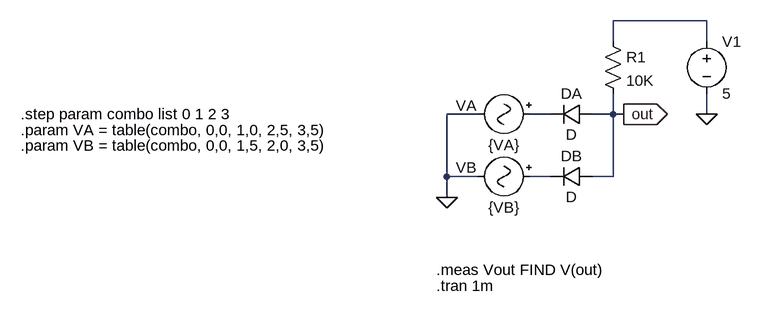
[diagram p0: schematic and_gate_diode.asc]
and_gate_diode.asc, the LTspice schematic file:
Version 4.1
SHEET 1 880 680
WIRE 304 0 160 0
WIRE 160 32 160 0
WIRE 304 32 304 0
WIRE -48 144 -96 144
WIRE 64 144 32 144
WIRE 160 144 160 112
WIRE 160 144 128 144
WIRE 176 144 160 144
WIRE 304 144 304 112
WIRE -96 240 -96 144
WIRE -48 240 -96 240
WIRE 64 240 32 240
WIRE 160 240 160 144
WIRE 160 240 128 240
WIRE -96 272 -96 240
FLAG 304 144 0
FLAG -96 272 0
FLAG 176 144 out
IOPIN 176 144 Out
SYMBOL diode 128 128 R90
WINDOW 0 0 32 VBottom 2
WINDOW 3 32 32 VTop 2
SYMATTR InstName DA
SYMBOL diode 128 224 R90
WINDOW 0 0 32 VBottom 2
WINDOW 3 32 32 VTop 2
SYMATTR InstName DB
SYMBOL res 144 16 R0
SYMATTR InstName R1
SYMATTR Value 10K
SYMBOL voltage 304 16 R0
WINDOW 123 0 0 Left 0
WINDOW 39 0 0 Left 0
SYMATTR InstName V1
SYMATTR Value 5
SYMBOL Misc\\signal 48 144 R90
WINDOW 0 2 114 VBottom 2
WINDOW 3 32 56 VTop 2
SYMATTR InstName VA
SYMATTR Value {VA}
SYMBOL Misc\\signal 48 240 R90
WINDOW 0 2 114 VBottom 2
WINDOW 3 32 56 VTop 2
WINDOW 123 0 0 Left 0
WINDOW 39 0 0 Left 0
SYMATTR InstName VB
SYMATTR Value {VB}
TEXT -752 168 Left 2 !.param VA = table(combo, 0,0, 1,0, 2,5, 3,5)
TEXT -752 192 Left 2 !.param VB = table(combo, 0,0, 1,5, 2,0, 3,5)
TEXT -112 384 Left 2 !.meas Vout FIND V(out)
TEXT -752 144 Left 2 !.step param combo list 0 1 2 3
TEXT -112 408 Left 2 !.tran 1m

The netlist it stands for:
* and_gate_diode.asc
DA out N002 D
DB out N003 D
R1 N001 out 10K
V1 N001 0 5
VA N002 0 {VA}
VB N003 0 {VB}
.model D D
.lib standard.dio
.param VA = table(combo, 0,0, 1,0, 2,5, 3,5)
.param VB = table(combo, 0,0, 1,5, 2,0, 3,5)
.meas Vout FIND V(out)
.step param combo list 0 1 2 3
.tran 1m
.backanno
.end